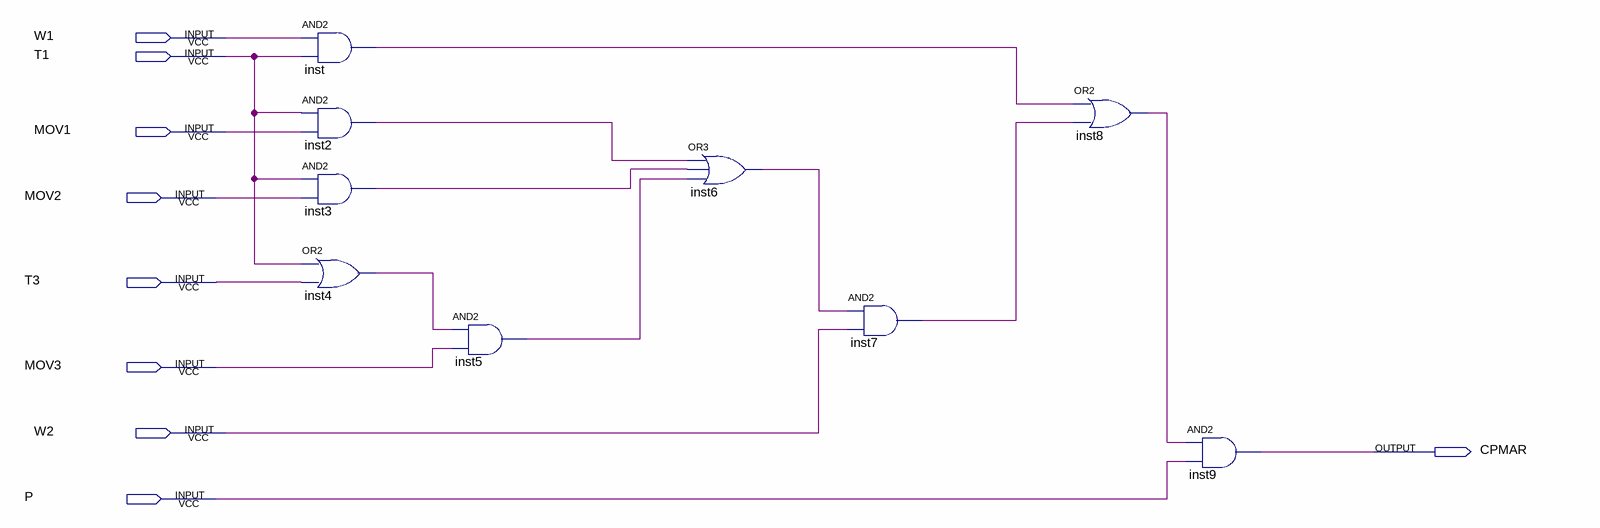
[diagram p0: schematic sheet]
// Quartus schematic CPMAR.bdf as structural Verilog: 9 symbols, 9 pins
module CPMAR (
  input  W1,
  input  T1,
  input  MOV1,
  input  MOV2,
  input  T3,
  input  MOV3,
  input  W2,
  input  P,
  output CPMAR
);

  wire inst2_out, inst3_out, inst4_out, inst5_out, inst6_out, inst7_out, inst8_out, inst_out;

  and inst (inst_out, W1, T1);
  and inst2 (inst2_out, T1, MOV1);
  and inst3 (inst3_out, T1, MOV2);
  or inst4 (inst4_out, T1, T3);
  and inst5 (inst5_out, inst4_out, MOV3);
  or inst6 (inst6_out, inst2_out, inst3_out, inst5_out);
  and inst7 (inst7_out, inst6_out, W2);
  or inst8 (inst8_out, inst_out, inst7_out);
  and inst9 (CPMAR, inst8_out, P);
endmodule
